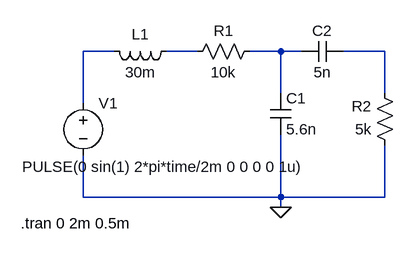
[diagram p0: schematic RDS Modulation.asc]
RDS Modulation.asc, the LTspice schematic file:
Version 4
SHEET 1 880 680
WIRE 96 64 48 64
WIRE 224 64 176 64
WIRE 352 64 304 64
WIRE 384 64 352 64
WIRE 512 64 448 64
WIRE 352 128 352 64
WIRE 512 128 512 64
WIRE 48 144 48 64
WIRE 48 288 48 224
WIRE 352 288 352 192
WIRE 352 288 48 288
WIRE 512 288 512 208
WIRE 512 288 352 288
WIRE 352 304 352 288
FLAG 352 304 0
SYMBOL voltage 48 128 R0
WINDOW 3 -94 113 Left 2
WINDOW 123 0 0 Left 2
WINDOW 39 0 0 Left 2
SYMATTR InstName V1
SYMATTR Value PULSE(0 sin(1) 2*pi*time/2m 0 0 0 0 1u)
SYMBOL res 320 48 R90
WINDOW 0 0 56 VBottom 2
WINDOW 3 32 56 VTop 2
SYMATTR InstName R1
SYMATTR Value 10k
SYMBOL res 528 224 R180
WINDOW 0 36 76 Left 2
WINDOW 3 36 40 Left 2
SYMATTR InstName R2
SYMATTR Value 5k
SYMBOL cap 336 128 R0
SYMATTR InstName C1
SYMATTR Value 5.6n
SYMBOL ind 192 48 R90
WINDOW 0 5 56 VBottom 2
WINDOW 3 32 56 VTop 2
SYMATTR InstName L1
SYMATTR Value 30m
SYMBOL cap 448 48 R90
WINDOW 0 0 32 VBottom 2
WINDOW 3 32 32 VTop 2
SYMATTR InstName C2
SYMATTR Value 5n
TEXT -48 328 Left 2 !.tran 0 2m 0.5m

The netlist it stands for:
* RDS Modulation.asc
V1 N001 0 PULSE(0 sin(1) 2*pi*time/2m 0 0 0 0 1u)
R1 N003 N002 10k
R2 0 N004 5k
C1 N003 0 5.6n
L1 N002 N001 30m
C2 N004 N003 5n
.tran 0 2m 0.5m
.backanno
.end